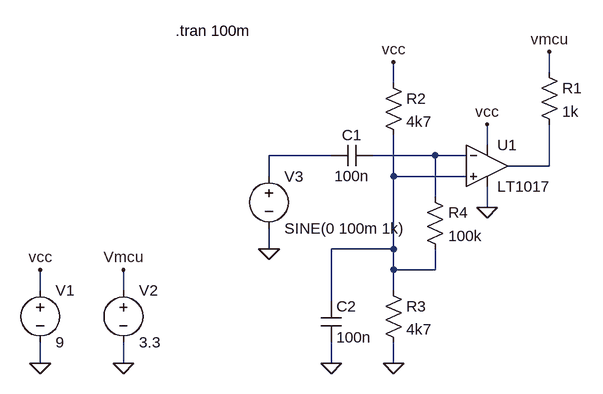
[diagram p0: schematic fuzz_factory_comp_01.asc]
fuzz_factory_comp_01.asc, the LTspice schematic file:
Version 4
SHEET 1 880 680
WIRE 416 16 416 -16
WIRE 176 32 176 0
WIRE 320 128 320 96
WIRE 80 144 -16 144
WIRE 240 144 144 144
WIRE 288 144 240 144
WIRE 416 160 416 96
WIRE 416 160 352 160
WIRE -16 176 -16 144
WIRE 176 176 176 112
WIRE 288 176 176 176
WIRE 240 208 240 144
WIRE 320 224 320 192
WIRE -16 288 -16 256
WIRE 176 288 176 176
WIRE 176 288 80 288
WIRE 176 320 176 288
WIRE 240 320 240 288
WIRE 240 320 176 320
WIRE -368 352 -368 320
WIRE -240 352 -240 320
WIRE 176 352 176 320
WIRE 80 368 80 288
WIRE -368 464 -368 432
WIRE -240 464 -240 432
WIRE 80 464 80 432
WIRE 176 464 176 432
FLAG -368 464 0
FLAG -368 320 vcc
FLAG -240 464 0
FLAG -240 320 Vmcu
FLAG 320 96 vcc
FLAG 320 224 0
FLAG 176 464 0
FLAG 80 464 0
FLAG -16 288 0
FLAG 176 0 vcc
FLAG 416 -16 vmcu
SYMBOL Comparators\\LT1017 320 160 R0
SYMATTR InstName U1
SYMBOL res 400 0 R0
SYMATTR InstName R1
SYMATTR Value 1k
SYMBOL voltage -368 336 R0
SYMATTR InstName V1
SYMATTR Value 9
SYMBOL voltage -240 336 R0
SYMATTR InstName V2
SYMATTR Value 3.3
SYMBOL res 160 16 R0
SYMATTR InstName R2
SYMATTR Value 4k7
SYMBOL cap 144 128 R90
WINDOW 0 0 32 VBottom 2
WINDOW 3 32 32 VTop 2
SYMATTR InstName C1
SYMATTR Value 100n
SYMBOL res 160 336 R0
SYMATTR InstName R3
SYMATTR Value 4k7
SYMBOL res 224 192 R0
SYMATTR InstName R4
SYMATTR Value 100k
SYMBOL cap 64 368 R0
SYMATTR InstName C2
SYMATTR Value 100n
SYMBOL voltage -16 160 R0
WINDOW 123 0 0 Left 0
WINDOW 39 0 0 Left 0
SYMATTR InstName V3
SYMATTR Value SINE(0 100m 1k)
TEXT -160 -48 Left 2 !.tran 100m

The netlist it stands for:
* fuzz_factory_comp_01.asc
XU1 N004 N002 vcc 0 N003 LT1017  ; pins In+ In- V+ V- OUT
R1 Vmcu N003 1k
V1 vcc 0 9
V2 Vmcu 0 3.3
R2 vcc N004 4k7
C1 N002 N001 100n
R3 N004 0 4k7
R4 N002 N004 100k
C2 N004 0 100n
V3 N001 0 SINE(0 100m 1k)
.tran 100m
.backanno
.end